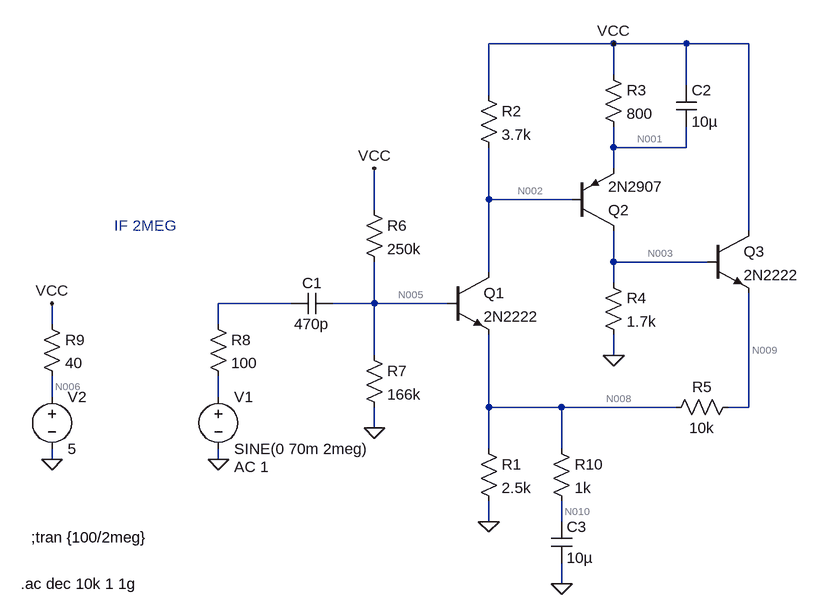
[diagram p0: schematic if_amp_2meg.asc]
if_amp_2meg.asc, the LTspice schematic file:
Version 4
SHEET 1 880 680
WIRE 304 -288 112 -288
WIRE 416 -288 304 -288
WIRE 512 -288 416 -288
WIRE 304 -240 304 -288
WIRE 416 -224 416 -288
WIRE 112 -208 112 -288
WIRE 304 -128 304 -160
WIRE 416 -128 416 -160
WIRE 416 -128 304 -128
WIRE 304 -96 304 -128
WIRE 112 -48 112 -128
WIRE 240 -48 112 -48
WIRE -64 -32 -64 -96
WIRE 512 0 512 -288
WIRE 304 48 304 0
WIRE 448 48 304 48
WIRE 112 64 112 -48
WIRE 304 80 304 48
WIRE -192 112 -304 112
WIRE -64 112 -64 48
WIRE -64 112 -128 112
WIRE 48 112 -64 112
WIRE -560 144 -560 112
WIRE -304 144 -304 112
WIRE -64 192 -64 112
WIRE 304 192 304 160
WIRE -560 256 -560 224
WIRE -304 256 -304 224
WIRE 112 272 112 160
WIRE 224 272 112 272
WIRE 400 272 224 272
WIRE 512 272 512 96
WIRE 512 272 480 272
WIRE -64 304 -64 272
WIRE 112 336 112 272
WIRE 224 336 224 272
WIRE -560 352 -560 336
WIRE -304 352 -304 336
WIRE 112 448 112 416
WIRE 224 448 224 416
WIRE 224 544 224 512
FLAG 112 448 0
FLAG 304 192 0
FLAG -64 304 0
FLAG -560 352 0
FLAG -304 352 0
FLAG -560 112 VCC
FLAG 304 -288 VCC
FLAG -64 -96 VCC
FLAG 224 544 0
SYMBOL npn 48 64 R0
SYMATTR InstName Q1
SYMATTR Value 2N2222
SYMBOL res 96 320 R0
SYMATTR InstName R1
SYMATTR Value 2.5k
SYMBOL res 96 -224 R0
SYMATTR InstName R2
SYMATTR Value 3.7k
SYMBOL pnp 240 0 M180
SYMATTR InstName Q2
SYMATTR Value 2N2907
SYMBOL res 288 -256 R0
SYMATTR InstName R3
SYMATTR Value 800
SYMBOL res 288 64 R0
SYMATTR InstName R4
SYMATTR Value 1.7k
SYMBOL npn 448 0 R0
SYMATTR InstName Q3
SYMATTR Value 2N2222
SYMBOL res 496 256 R90
WINDOW 0 0 56 VBottom 2
WINDOW 3 32 56 VTop 2
SYMATTR InstName R5
SYMATTR Value 10k
SYMBOL res -80 -48 R0
SYMATTR InstName R6
SYMATTR Value 250k
SYMBOL res -80 176 R0
SYMATTR InstName R7
SYMATTR Value 166k
SYMBOL cap -128 96 R90
WINDOW 0 0 32 VBottom 2
WINDOW 3 32 32 VTop 2
SYMATTR InstName C1
SYMATTR Value 470p
SYMBOL voltage -304 240 R0
WINDOW 123 24 124 Left 2
WINDOW 39 0 0 Left 0
SYMATTR Value2 AC 1
SYMATTR InstName V1
SYMATTR Value SINE(0 70m 2meg)
SYMBOL voltage -560 240 R0
WINDOW 123 0 0 Left 0
WINDOW 39 0 0 Left 0
SYMATTR InstName V2
SYMATTR Value 5
SYMBOL res -320 128 R0
SYMATTR InstName R8
SYMATTR Value 100
SYMBOL res -576 128 R0
SYMATTR InstName R9
SYMATTR Value 40
SYMBOL cap 400 -224 R0
SYMATTR InstName C2
SYMATTR Value 10µ
SYMBOL cap 208 448 R0
SYMATTR InstName C3
SYMATTR Value 10µ
SYMBOL res 208 320 R0
SYMATTR InstName R10
SYMATTR Value 1k
TEXT -592 472 Left 2 !;tran {100/2meg}
TEXT -608 544 Left 2 !.ac dec 10k 1 1g
TEXT -464 -8 Left 2 ;IF 2MEG

The netlist it stands for:
* if_amp_2meg.asc
Q1 N002 N005 N008 0 2N2222
R1 N008 0 2.5k
R2 VCC N002 3.7k
Q2 N003 N002 N001 0 2N2907
R3 VCC N001 800
R4 N003 0 1.7k
Q3 VCC N003 N009 0 2N2222
R5 N009 N008 10k
R6 VCC N005 250k
R7 N005 0 166k
C1 N005 N004 470p
V1 N007 0 SINE(0 70m 2meg) AC 1
V2 N006 0 5
R8 N004 N007 100
R9 VCC N006 40
C2 VCC N001 10µ
C3 N010 0 10µ
R10 N008 N010 1k
.model NPN NPN
.model PNP PNP
.lib standard.bjt
;tran {100/2meg}
.ac dec 10k 1 1g
* IF 2MEG
.backanno
.end

* Results of the author's LTspice run, read from the files saved beside the schematic
* Operating Point, zero values left out:
*   V(n002) = 3.376 V
*   V(n005) = 1.76 V
*   V(n008) = 1.128 V
*   V(vcc) = 4.937 V
*   V(n003) = 1.91 V
*   V(n001) = 4.034 V
*   V(n009) = 1.354 V
*   V(n006) = 5 V
*   V(n010) = 1.128 V
*   Ic(Q1) = 426.3 µA
*   Ib(Q1) = 2.1 µA
*   Ie(Q1) = -428.4 µA
*   Ic(Q3) = 22.53 µA
*   Ib(Q3) = 109.3 nA
*   Ie(Q3) = -22.64 µA
*   Ic(Q2) = -1.124 mA
*   Ib(Q2) = -4.457 µA
*   Ie(Q2) = 1.128 mA
*   I(R1) = 451 µA
*   I(R2) = 421.8 µA
*   I(R3) = 1.128 mA
*   I(R4) = 1.124 mA
*   I(R5) = 22.64 µA
*   I(R6) = 12.7 µA
*   I(R7) = 10.6 µA
*   I(R9) = -1.585 mA
*   I(V2) = -1.585 mA